# Altium project DCDC.PrjPcb (part 8 of 9)
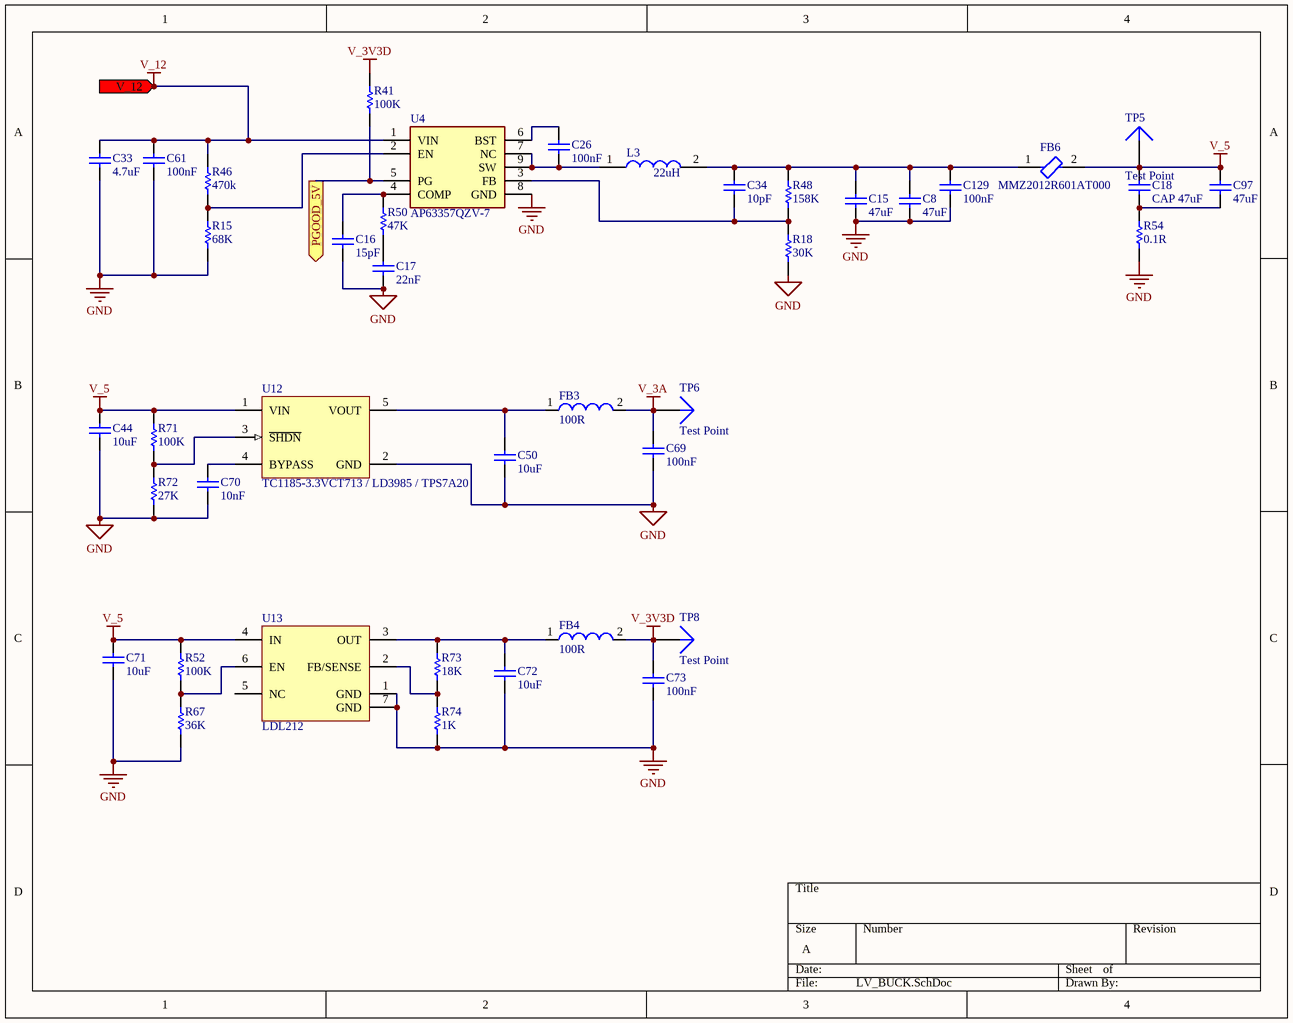
[diagram p14: LV_BUCK.SchDoc]

## Sheet LV_BUCK.SchDoc (continued)

### Library data of the parts (continued)
R72 = CMP-2100-03662-1: ±1% ±100ppm/℃ 0.1W 27kΩ 0603 Chip Resistor - Surface Mount ROHS; Manufacturer: Yageo; Manufacturer Part Number: RC0603FR-07100KL; Power Rating: 100mW; Voltage Rating: 50V; Resistance: 100KOhm; Temperature Coefficient: 100ppm/degreesC; Working Voltage: 75V; Datasheet Version: Rev. 5, 10/2016; Height: 0.45mm; Lead Free: LeadFree; Manufacturer URL: http://www.yageo.com/; Package Reference: 0603; Depth: 0.8mm; RoHSCompliant: true; Composition: ThickFilm; Military Standard: Not; Case/Package: 0603; Packaging: TapeandReel; Case Code (Imperial): 0603; Voltage Rating (DC): 50V; Case Code (Metric): 1608; Tolerance: 1%; Termination: SMD/SMT; Min Operating Temperature: -55degC; Number of Pins: 2; Length: 1.6mm; Width: 0.8mm; Datasheet URL: http://www.yageo.com/NewPortal/yageodocoutput?fileName=/pdf/R-Chip/PYu-RC_Group_51_RoHS_L_5.pdf; Package Description: 2-Pin Surface Mount Device, Body 1.6 x 0.8 mm; Max Operating Temperature: 155degC; REACH SVHC: NoSVHC; Supplier 1: Digi-Key; Supplier Part Number 1: 311-100KHRCT-ND; RoHS: Yes; Category: Chip SMD Resistors; Stock 1: 19283456; Pricing 1: 1=0.10000, 10=0.02400, 100=0.00970, 1000=0.00436, 2500=0.00378 (USD); Series: RC; Max Power Dissipation: 100mW; Resistor Type: Thick Film; Number of Terminations: 2; Resistance Tolerance: 1%; Features: Moisture Resistant; Construction: Rectangular; Technology: THICK FILM; RoHS Compliant: Yes; ComponentLink1URL: https://datasheet.ciiva.com/11808/0900766b80f96399-11808107.pdf?src-supplier=RSComponents; ComponentLink1Description: https://datasheet.ciiva.com/11808/0900766b80f96399-11808107.pdf?src-supplier=RSComponents; ComponentLink2URL: https://datasheet.ciiva.com/7983/443971-7983593.pdf?src-supplier=Element14; ComponentLink2Description: https://datasheet.ciiva.com/7983/443971-7983593.pdf?src-supplier=Element14; ComponentLink3URL: https://datasheet.ciiva.com/46440/1868787-46440889.pdf?src-supplier=Element14; ComponentLink3Description: https://datasheet.ciiva.com/46440/1868787-46440889.pdf?src-supplier=Element14; ComponentLink4URL: https://datasheet.ciiva.com/7746/1738695-7746234.pdf?src-supplier=Element14; ComponentLink4Description: https://datasheet.ciiva.com/7746/1738695-7746234.pdf?src-supplier=Element14; ComponentLink5URL: https://datasheet.ciiva.com/7746/1738695-7746235.pdf?src-supplier=Element14; ComponentLink5Description: https://datasheet.ciiva.com/7746/1738695-7746235.pdf?src-supplier=Element14; ComponentLink6URL: https://datasheet.ciiva.com/22747/443971-22747516.pdf?src-supplier=Element14; ComponentLink6Description: https://datasheet.ciiva.com/22747/443971-22747516.pdf?src-supplier=Element14; Parameter 1: *; JLCPCB Part #: C22967
R73 = CMP-2000-00938-1: 18kΩ ±1% ±100ppm/℃ 0.1W 0603 Chip Resistor - Surface Mount ROHS; Manufacturer: Panasonic; Part Number: ERA3AEB183V; Manufacturer Part Number: ERA-3AEB183V; Resistance: 18kR; Power Rating: 100mW; Tolerance: 0.1%; Temperature Coefficient: 25ppm/°C; Voltage Rating (DC): 75V; Supplier 1: Newark; Supplier Part Number 1: 08N2107; RoHS: Yes; Category: Chip SMD Resistors; Stock 1: 2207; Pricing 1: 1=0.35700, 25=0.30700, 50=0.21600, 100=0.12400, 250=0.10000, 500=0.07500, 1000=0.05100 (USD); Mount: Surface Mount; Case/Package: 0603; Number of Pins: 2; Case Code (Metric): 1608; Case Code (Imperial): 0603; Contact Plating: Tin; Size Code: 0603; Min Operating Temperature: -55°C; Max Operating Temperature: 155°C; Packaging: Tape and Reel; Resistor Type: Thin Film; Number of Terminations: 2; Max Power Dissipation: 100mW; Series: ERA-3A; Voltage Rating: 75V; Package Quantity: 1; Termination: SMD/SMT; Features: Automotive AEC-Q200; Resistance Tolerance: 0.1%; Construction: Rectangular; Technology: METAL FILM; Length: 1.6mm; Width: 0.8mm; Height: 0.45mm; Depth: 0.8mm; Radiation Hardening: No; RoHS Compliant: Yes; Lead Free: Lead Free; REACH SVHC: No SVHC; Military Standard: Not; ComponentLink1URL: https://datasheet.ciiva.com/11808/0900766b80fe20f7-11808020.pdf?src-supplier=RSComponents; ComponentLink1Description: https://datasheet.ciiva.com/11808/0900766b80fe20f7-11808020.pdf?src-supplier=RSComponents; ComponentLink2URL: https://datasheet.ciiva.com/29183/451333-da-01-en-widerstand-0603-era-29183823.pdf?src-supplier=Conrad; ComponentLink2Description: https://datasheet.ciiva.com/29183/451333-da-01-en-widerstand-0603-era-29183823.pdf?src-supplier=Conrad; ComponentLink3URL: https://datasheet.ciiva.com/16395/aoa0000ce26-16395253.pdf?src-supplier=Future+Electronics; ComponentLink3Description: https://datasheet.ciiva.com/16395/aoa0000ce26-16395253.pdf?src-supplier=Future+Electronics; ComponentLink4URL: https://datasheet.ciiva.com/16764/70068849-16764837.pdf?src-supplier=Allied+Electronics; ComponentLink4Description: https://datasheet.ciiva.com/16764/70068849-16764837.pdf?src-supplier=Allied+Electronics; ComponentLink5URL: https://datasheet.ciiva.com/9117/aoa0000ce26-9117398.pdf?src-supplier=Avnet; ComponentLink5Description: https://datasheet.ciiva.com/9117/aoa0000ce26-9117398.pdf?src-supplier=Avnet; ComponentLink6URL: https://datasheet.ciiva.com/17211/aoa0000ce26-17211238.pdf?src-supplier=Avnet+Europe; ComponentLink6Description: https://datasheet.ciiva.com/17211/aoa0000ce26-17211238.pdf?src-supplier=Avnet+Europe; ComponentLink7URL: https://datasheet.ciiva.com/22739/485442-22739288.pdf?src-supplier=Element14; ComponentLink7Description: https://datasheet.ciiva.com/22739/485442-22739288.pdf?src-supplier=Element14; ComponentLink8URL: https://datasheet.ciiva.com/48425/era-eng-tds-48425433.pdf?src-supplier=Distrelec; ComponentLink8Description: https://datasheet.ciiva.com/48425/era-eng-tds-48425433.pdf?src-supplier=Distrelec; ComponentLink9URL: https://datasheet.ciiva.com/48530/era-eng-tds-48530218.pdf?src-supplier=Distrelec; ComponentLink9Description: https://datasheet.ciiva.com/48530/era-eng-tds-48530218.pdf?src-supplier=Distrelec; ComponentLink10URL: https://datasheet.ciiva.com/5860/485442-5860507.pdf?src-supplier=Farnell; ComponentLink10Description: https://datasheet.ciiva.com/5860/485442-5860507.pdf?src-supplier=Farnell; ComponentLink11URL: https://datasheet.ciiva.com/16771/70068849-16771099.pdf?src-supplier=Allied+Electronics; ComponentLink11Description: https://datasheet.ciiva.com/16771/70068849-16771099.pdf?src-supplier=Allied+Electronics; ComponentLink12URL: https://datasheet.ciiva.com/5860/485442-5860508.pdf?src-supplier=Farnell; ComponentLink12Description: https://datasheet.ciiva.com/5860/485442-5860508.pdf?src-supplier=Farnell; ComponentLink13URL: https://datasheet.ciiva.com/7944/485442-7944492.pdf?src-supplier=Element14; ComponentLink13Description: https://datasheet.ciiva.com/7944/485442-7944492.pdf?src-supplier=Element14; ComponentLink14URL: https://datasheet.ciiva.com/30234/54aoa0000ce26-30234638.pdf?src-supplier=Onlinecomponents.com; ComponentLink14Description: https://datasheet.ciiva.com/30234/54aoa0000ce26-30234638.pdf?src-supplier=Onlinecomponents.com; ComponentLink15URL: https://datasheet.ciiva.com/46422/485442-46422590.pdf?src-supplier=Element14; ComponentLink15Description: https://datasheet.ciiva.com/46422/485442-46422590.pdf?src-supplier=Element14; ComponentLink16URL: https://datasheet.ciiva.com/46422/485442-46422591.pdf?src-supplier=Element14; ComponentLink16Description: https://datasheet.ciiva.com/46422/485442-46422591.pdf?src-supplier=Element14; Parameter 1: *; JLCPCB Part #: C25810
R74 = CMP-2000-00180-1: ±1% ±100ppm/℃ 1kΩ 0.1W 0603 Chip Resistor - Surface Mount ROHS; Part Number: ERJ-3EKF1001V; Manufacturer: Panasonic; Manufacturer Part Number: ERJ3EKF1001V; Resistance: 1kR; Power Rating: 100mW; Voltage Rating: 75V; Temperature Coefficient: 100ppm/°C; Supplier 1: Future Electronics; Supplier Part Number 1: 3028514; RoHS: Yes; Category: Chip SMD Resistors; Stock 1: 430000; Pricing 1: 5000=0.01860, 10000=0.01510, 15000=0.01500, 20000=0.01490 (USD); Mount: Surface Mount; Case/Package: 0603; Number of Pins: 2; Case Code (Metric): 1608; Case Code (Imperial): 0603; Contact Plating: Tin; Size Code: 0603; Min Operating Temperature: -55°C; Max Operating Temperature: 155°C; Packaging: Tape and Reel; Tolerance: 1%; Termination: SMD/SMT; Package Quantity: 5000; Series: ERJ; Resistor Type: Thick Film; Max Power Dissipation: 100mW; Construction: Rectangular; Resistance Tolerance: 1%; Number of Terminations: 2; Features: Automotive AEC-Q200; Voltage Rating (DC): 75V; Technology: THICK FILM; Length: 1.6mm; Width: 0.8mm; Height: 0.45mm; Depth: 0.8mm; Radiation Hardening: No; REACH SVHC: No SVHC; Lead Free: Lead Free; RoHS Compliant: Yes; Military Standard: Not; ComponentLink1URL: https://datasheet.ciiva.com/16768/70260748-16768437.pdf?src-supplier=Allied+Electronics; ComponentLink1Description: https://datasheet.ciiva.com/16768/70260748-16768437.pdf?src-supplier=Allied+Electronics; ComponentLink2URL: https://datasheet.ciiva.com/16774/70260748-16774550.pdf?src-supplier=Allied+Electronics; ComponentLink2Description: https://datasheet.ciiva.com/16774/70260748-16774550.pdf?src-supplier=Allied+Electronics; ComponentLink3URL: https://datasheet.ciiva.com/16449/aoa0000ce2-16449065.pdf?src-supplier=Future+Electronics; ComponentLink3Description: https://datasheet.ciiva.com/16449/aoa0000ce2-16449065.pdf?src-supplier=Future+Electronics; ComponentLink4URL: https://datasheet.ciiva.com/7942/aoa0000ce2-7942427.pdf?src-supplier=Element14; ComponentLink4Description: https://datasheet.ciiva.com/7942/aoa0000ce2-7942427.pdf?src-supplier=Element14; ComponentLink5URL: https://datasheet.ciiva.com/9198/aoa0000ce2-9198923.pdf?src-supplier=Avnet; ComponentLink5Description: https://datasheet.ciiva.com/9198/aoa0000ce2-9198923.pdf?src-supplier=Avnet; ComponentLink6URL: https://datasheet.ciiva.com/46373/1678782-46373339.pdf?src-supplier=Element14; ComponentLink6Description: https://datasheet.ciiva.com/46373/1678782-46373339.pdf?src-supplier=Element14; ComponentLink7URL: https://datasheet.ciiva.com/48530/aoa0000ce2-48530987.pdf?src-supplier=Avnet; ComponentLink7Description: https://datasheet.ciiva.com/48530/aoa0000ce2-48530987.pdf?src-supplier=Avnet; ComponentLink8URL: https://datasheet.ciiva.com/46373/1678782-46373340.pdf?src-supplier=Element14; ComponentLink8Description: https://datasheet.ciiva.com/46373/1678782-46373340.pdf?src-supplier=Element14; ComponentLink9URL: https://datasheet.ciiva.com/24070/aoa0000ce2-24070269.pdf?src-supplier=Mouser; ComponentLink9Description: https://datasheet.ciiva.com/24070/aoa0000ce2-24070269.pdf?src-supplier=Mouser; ComponentLink10URL: https://datasheet.ciiva.com/22673/1678782-22673918.pdf?src-supplier=Element14; ComponentLink10Description: https://datasheet.ciiva.com/22673/1678782-22673918.pdf?src-supplier=Element14; ComponentLink11URL: https://datasheet.ciiva.com/30063/aoa0000ce2-30063390.pdf?src-supplier=Onlinecomponents.com; ComponentLink11Description: https://datasheet.ciiva.com/30063/aoa0000ce2-30063390.pdf?src-supplier=Onlinecomponents.com; ComponentLink12URL: https://datasheet.ciiva.com/17215/aoa0000ce2-17215311.pdf?src-supplier=Avnet+Europe; ComponentLink12Description: https://datasheet.ciiva.com/17215/aoa0000ce2-17215311.pdf?src-supplier=Avnet+Europe; Parameter 1: *; JLCPCB Part #: C21190
TP5 TP6 TP8 = Test_Point 1.5mm round: Round Test Point; LatestRevisionDate: 17-Jul-2002; LatestRevisionNote: Re-released for DXP Platform.; Publisher: Altium Limited; Parameter 1: *; JLCPCB Part #: *
U4 = AP63357QZV-7: Integrated Circuit; Manufacturer_Name: Diodes Inc.; Datasheet Link: https://www.diodes.com/assets/Datasheets/AP63356Q_AP63357Q.pdf; Height: 0.85mm; Manufacturer_Part_Number: AP63357QZV-7; Mouser Part Number: 621-AP63357QZV-7; Mouser Price/Stock: https://www.mouser.co.uk/ProductDetail/Diodes-Incorporated/AP63357QZV-7?qs=DPoM0jnrROUeS%2FU8ZrDy%2FA%3D%3D; Parameter 1: *; JLCPCB Part #: *
U12 = PM-LINEREG-TC1014-IL5: 50 mA, 100 mA and 150 mA CMOS LDOs with Active-Low Shutdown and Reference Bypass, 5-Pin SOT-23, Extended Temperature, Tape and Reel; PackageVersion: revBB, Aug-2009; Code_IPC: SOT23-5; PackageDescription: 5-Lead Plastic Small Outline Transistor (CT) [SOT-23]; DatasheetVersion: revE, Feb-2007; PackageReference: SOT-23-CT5; Parameter 1: *; JLCPCB Part #: *
U13 = LDL212: Parameter 1: *; JLCPCB Part #: *

## Sheet CAN.SchDoc
size A; SheetNumber: 7; SheetTotal: 8
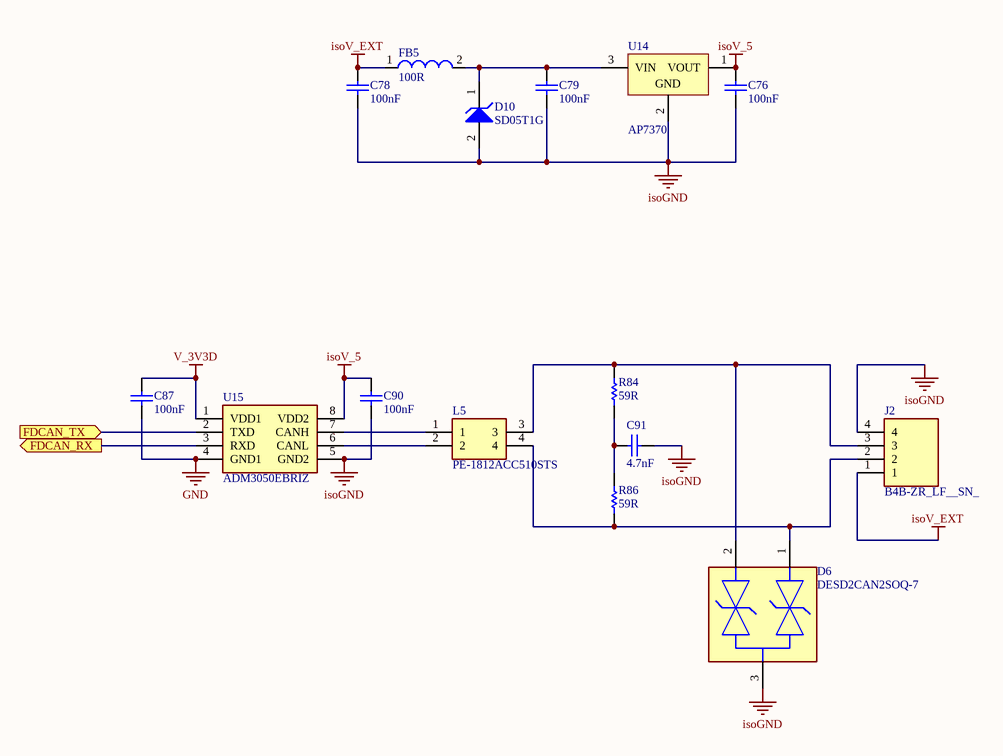
[diagram p7: CAN.SchDoc]

### Parts
C76  100nF  [CAPC1608X90X35NL10T15]
C78  100nF  [CAPC1608X90X35NL10T15]
C79  100nF  [CAPC1608X90X35NL10T15]
C87  100nF  [CAPC1608X90X35NL10T15]
C90  100nF  [CAPC1608X90X35NL10T15]
C91  4.7nF  [CAPC1608X90X35ML10T15]
D6  DESD2CAN2SOQ-7  [FP-SOT23-MFG]
D10  SD05T1G  [ONSC-SOD-323-2-477-02_G_V]
FB5  100R  [SMD-0603]
J2  B4B-ZR_LF__SN_  [SHDR4W50P0X150_1X4_750X350X450P]
L5  PE-1812ACC510STS  [PE1812ACC510STS]
R84  59R  [RESC1608X55X30ML15T15]
R86  59R  [RESC1608X55X30ML15T15]
U14  AP7370  [SOT-89_L]
U15  ADM3050EBRIZ  [SOIC127P1031X265-8N]

### Ports
FDCAN_RX (out), FDCAN_TX (in)

### Nets
GND: C87.1 U15.4(GND1)
isoGND: C76.1 C78.1 C79.1 C90.1 C91.2 D6.3 D10.2(A) J2.4 U14.2(GND) U15.5(GND2)
isoV_5: C76.2 C90.2 U14.1(VOUT) U15.8(VDD2)
isoV_EXT: C78.2 FB5.1 J2.1
V_3V3D: C87.2 U15.1(VDD1)
NetC79_2: C79.2 D10.1(K) FB5.2 U14.3(VIN)
NetC91_1: C91.1 R84.1 R86.2
NetD6_1: D6.1 J2.2 L5.4 R86.1
NetD6_2: D6.2 J2.3 L5.3 R84.2
NetL5_1: L5.1 U15.7(CANH)
NetL5_2: L5.2 U15.6(CANL)
NetU1_108: U15.3(RXD) ; port FDCAN_RX
NetU1_109: U15.2(TXD) ; port FDCAN_TX

### Library data of the parts
C76 C78 C79 C87 C90 = CAP: X7R 100nF ±10% 50V 0603 Multilayer Ceramic Capacitors MLCC - SMD/SMT ROHS; Part Number: GCM188R72A104KA64D; Manufacturer: Murata; Manufacturer Part Number: CC0603KRX7R9BB104; Voltage Rating: 100V; Supplier 1: Arrow Electronics; Supplier Part Number 1: GCM188R72A104KA64D; RoHS: Yes; Category: Ceramic Capacitors; Mount: Surface Mount; Case/Package: 0603; Case Code (Imperial): 0603; Case Code (Metric): 1608; Min Operating Temperature: -55°C; Max Operating Temperature: 125°C; Tolerance: 10%; Packaging: Tape and Reel; Capacitance: 100nF; Dielectric: X7R; Termination: SMD/SMT; Voltage Rating (DC): 100V; Length: 1.6mm; Height: 0.8mm; Depth: 0.8mm; Radiation Hardening: No; ComponentLink1URL: https://datasheet.ciiva.com/17451/product-17451047.pdf?src-supplier=Avnet+Europe; ComponentLink1Description: https://datasheet.ciiva.com/17451/product-17451047.pdf?src-supplier=Avnet+Europe; ComponentLink2URL: https://datasheet.ciiva.com/26889/getdatasheetpartid-387765-26889164.pdf?src-supplier=Verical; ComponentLink2Description: https://datasheet.ciiva.com/26889/getdatasheetpartid-387765-26889164.pdf?src-supplier=Verical; Parameter 1: *; JLCPCB Part #: C14663
C91 = CMP-2006-02924-1: X7R ±10% 4.7nF 50V 0603 Multilayer Ceramic Capacitors MLCC - SMD/SMT ROHS; Part Number: GRM188R71H472KA01D; Manufacturer: Murata; Insulation Resistance: 10GR; Supplier 1: Farnell; Supplier Part Number 1: 1118177; Manufacturer Part Number: GRM188R71H472KA01D; RoHS: Yes; Category: Ceramic Capacitors; Pricing 1: 1=19.92000, 3=19.13000 (GBP); Mount: Surface Mount; Case/Package: 0603; Number of Pins: 2; Case Code (Imperial): 0603; Case Code (Metric): 1608; Dielectric Material: Ceramic; Material: Ceramic; Min Operating Temperature: -55°C; Max Operating Temperature: 125°C; Capacitance: 4.7nF; Voltage Rating (DC): 50V; Tolerance: 10%; Packaging: Tape and Reel; Dielectric: X7R; Series: GRM; Voltage Rating: 50V; Package Quantity: 1; Termination: SMD/SMT; Voltage: 50V; Length: 1.6mm; Width: 0.8mm; Height: 0.8mm; Depth: 0.8mm; Thickness: 0.035inch; Radiation Hardening: No; RoHS Compliant: Yes; REACH SVHC: No SVHC; Lead Free: Lead Free; ComponentLink1URL: https://datasheet.ciiva.com/5412/product-5412608.pdf?src-supplier=Mouser; ComponentLink1Description: https://datasheet.ciiva.com/5412/product-5412608.pdf?src-supplier=Mouser; ComponentLink2URL: https://datasheet.ciiva.com/18102/getdatasheetpartid-75298-18102657.pdf?src-supplier=Verical; ComponentLink2Description: https://datasheet.ciiva.com/18102/getdatasheetpartid-75298-18102657.pdf?src-supplier=Verical; ComponentLink3URL: https://datasheet.ciiva.com/11787/0900766b8003061f-11787116.pdf?src-supplier=RSComponents; ComponentLink3Description: https://datasheet.ciiva.com/11787/0900766b8003061f-11787116.pdf?src-supplier=RSComponents; ComponentLink4URL: https://datasheet.ciiva.com/29201/451888-da-01-en-vs-kondensator-0603-29201828.pdf?src-supplier=Conrad; ComponentLink4Description: https://datasheet.ciiva.com/29201/451888-da-01-en-vs-kondensator-0603-29201828.pdf?src-supplier=Conrad; ComponentLink5URL: https://datasheet.ciiva.com/7937/4360-7937669.pdf?src-supplier=Element14; ComponentLink5Description: https://datasheet.ciiva.com/7937/4360-7937669.pdf?src-supplier=Element14; ComponentLink6URL: https://datasheet.ciiva.com/48428/nmgrm-data-en-48428597.pdf?src-supplier=Distrelec; ComponentLink6Description: https://datasheet.ciiva.com/48428/nmgrm-data-en-48428597.pdf?src-supplier=Distrelec; ComponentLink7URL: https://datasheet.ciiva.com/7937/4360-7937670.pdf?src-supplier=Element14; ComponentLink7Description: https://datasheet.ciiva.com/7937/4360-7937670.pdf?src-supplier=Element14; ComponentLink8URL: https://datasheet.ciiva.com/7937/4360-7937671.pdf?src-supplier=Element14; ComponentLink8Description: https://datasheet.ciiva.com/7937/4360-7937671.pdf?src-supplier=Element14; ComponentLink9URL: https://datasheet.ciiva.com/130/partnumbering-e-01-130733.pdf?src-supplier=Digi-Key; ComponentLink9Description: https://datasheet.ciiva.com/130/partnumbering-e-01-130733.pdf?src-supplier=Digi-Key; ComponentLink10URL: https://datasheet.ciiva.com/130/partnumbering-e-01-130734.pdf?src-supplier=Digi-Key; ComponentLink10Description: https://datasheet.ciiva.com/130/partnumbering-e-01-130734.pdf?src-supplier=Digi-Key; ComponentLink11URL: https://datasheet.ciiva.com/130/partnumbering-e-01-130735.pdf?src-supplier=Digi-Key; ComponentLink11Description: https://datasheet.ciiva.com/130/partnumbering-e-01-130735.pdf?src-supplier=Digi-Key; Parameter 1: *; JLCPCB Part #: C53987
D6 = CMP-12828-000016-1: TVS DIODE 24V 41V SOT23; Manufacturer: Diodes Inc.; Peak Pulse Current: 5A; Automotive Grade: Grade 0; Value: 25pF; Number Of Channels: 2; Direction: Bidirectional; Max Junction Temp: +150°C; Breakdown Voltage: 25.4V; Peak Pulse Power: 230W; Standoff Height: 0.013mm; ComponentLink2Description: Datasheet; Temperature Range High: +150°C; Device Class L2: TVS Diodes; Octopart: https://octopart.com/desd2can2soq-7-diodes+inc.-53081564; Device Class L3: unset; RoHS: TRUE; ComponentLink2URL: https://www.diodes.com/assets/Datasheets/DESD2CAN2SOQ.pdf; Height: 1.1mm; Digikey Description: TVS DIODE 24V 41V SOT23; Footprint Url: https://www.diodes.com/assets/Package-Files/SOT23.pdf; Manufacturer Part Number: DESD2CAN2SOQ-7; Package: SOT23; Temperature: -65°C to +150°C; Mouser Description: ESD Suppressors / TVS Diodes Dual CAN Bus ESD 25pF 24V 25.4V; Capacitance: 25pF; Category: Diode; Clamping Voltage: 41V; Lead Free: Yes; Reverse Standoff Voltage: 24V; Device Class L1: Circuit Protection; Temperature Range Low: -65°C; Automotive: Yes; Parameter 1: *; JLCPCB Part #: *
D10 = CMP-1061-00629-1: Transient Voltage Suppressor Diode, for ESD Protection, 2-Pin SOD-323, Pb-Free, Tape and Reel; Manufacturer: On Semiconductor; PPK Max (W): 350; IR Max (uA): 10; Direction: Unidirectional; ComponentLink1Description: Manufacturer URL; PackageReference: SOD-323-2-477-02_G; Mounting Technology: Surface Mount; PackageVersion: Rev. G, 02/2005; ComponentLink2URL: http://www.onsemi.com/pub_link/Collateral/SD05T1-D.PDF; PackageDescription: 2-Pin SOD, Body 1.7 x 1.25 mm; Packing: Tape and Reel; ComponentLink2Description: Datasheet; ComponentLink1URL: http://www.onsemi.com/; ComponentLink3Description: Package Specification; ComponentLink3URL: http://www.onsemi.com/pub_link/Collateral/SD05T1-D.PDF; PartNumber: SD05T1G; RoHS: Pb-Free; DatasheetVersion: Rev. 2; Parameter 1: *; JLCPCB Part #: *
FB5 = CMP-0220-00115-1: SMD EMI Suppression Ferrite Bead WE-CBF, Z = 1500 Ohm; DatasheetVersion: Dec-2005; ComponentLink1URL: http://www.we-online.com; PackageVersion: 2009; PackageDescription: Chip Inductor, 2-Leads, Body 1.6 x 0.8 mm; ComponentLink2URL: http://www.we-online.de/katalog/media/pdf/742792691.pdf; ComponentLink1Description: Manufacturer Link; ComponentLink2Description: Datasheet; Impedance: 1500 Ohm; PackageReference: SMD-0603; Parameter 1: *; JLCPCB Part #: *
J2 = B4B-ZR_LF__SN_: Connector; Manufacturer_Name: JST (JAPAN SOLDERLESS TERMINALS); Manufacturer_Part_Number: B4B-ZR(LF)(SN); Datasheet Link: http://docs-emea.rs-online.com/webdocs/1147/0900766b81147f94.pdf; Height: 4.5mm; Arrow Part Number: B4B-ZR(LF)(SN); Arrow Price/Stock: https://www.arrow.com/en/products/b4b-zr-lf-sn/jst-manufacturing; Parameter 1: *; JLCPCB Part #: *
L5 = PE-1812ACC510STS: Inductor; Manufacturer_Name: Pulse; Datasheet Link: https://productfinder.pulseeng.com/doc_type/WEB301/doc_num/W717/doc_part/W717.pdf; Height: 3mm; Manufacturer_Part_Number: PE-1812ACC510STS; Mouser Part Number: 673-PE-1812ACC510STS; Mouser Price/Stock: https://www.mouser.co.uk/ProductDetail/Pulse-Electronics/PE-1812ACC510STS?qs=ar8LaIfZsbGrh9tcPYNGNA%3D%3D; Arrow Part Number: PE-1812ACC510STS; Arrow Price/Stock: https://www.arrow.com/en/products/pe-1812acc510sts/pulse-electronics-corporation; Parameter 1: *; JLCPCB Part #: *
R84 R86 = CMP-2000-00583-1: Manufacturer: Panasonic; Part Number: ERJ-3EKF59R0V; Power Rating: 100mW; Tolerance: 1%; Temperature Coefficient: 100ppm/°C; Voltage Rating: 75V; Voltage Rating (DC): 50V; Supplier 1: Digi-Key; Supplier Part Number 1: P59.0HCT-ND; Manufacturer Part Number: ERJ-3EKF59R0V; RoHS: Yes; Category: Chip SMD Resistors; Stock 1: 12961; Pricing 1: 1=0.10000, 10=0.03700, 100=0.01490, 1000=0.00670, 2500=0.00582 (USD); Mount: Surface Mount; Case/Package: 0603; Case Code (Metric): 1608; Case Code (Imperial): 0603; Contact Plating: Tin; Min Operating Temperature: -55°C; Max Operating Temperature: 155°C; Resistance: 59R; Packaging: Tape and Reel; Resistor Type: Thick Film; Number of Terminations: 2; Package Quantity: 1; Max Power Dissipation: 100mW; Series: ERJ; Termination: SMD/SMT; Resistance Tolerance: 1%; Features: Automotive AEC-Q200; Technology: THICK FILM; Construction: Rectangular; Length: 1.6mm; Width: 0.031inch; Height: 0.45mm; Depth: 0.8mm; RoHS Compliant: Yes; REACH SVHC: Yes; Lead Free: Contains Lead; Military Standard: Not; ComponentLink1URL: https://datasheet.ciiva.com/9188/aoa0000ce2-9188485.pdf?src-supplier=Avnet; ComponentLink1Description: https://datasheet.ciiva.com/9188/aoa0000ce2-9188485.pdf?src-supplier=Avnet; ComponentLink2URL: https://datasheet.ciiva.com/46420/1678782-46420341.pdf?src-supplier=Element14; ComponentLink2Description: https://datasheet.ciiva.com/46420/1678782-46420341.pdf?src-supplier=Element14; ComponentLink3URL: https://datasheet.ciiva.com/22729/1678782-22729158.pdf?src-supplier=Farnell; ComponentLink3Description: https://datasheet.ciiva.com/22729/1678782-22729158.pdf?src-supplier=Farnell; ComponentLink4URL: https://datasheet.ciiva.com/22673/1678782-22673800.pdf?src-supplier=Element14; ComponentLink4Description: https://datasheet.ciiva.com/22673/1678782-22673800.pdf?src-supplier=Element14; ComponentLink5URL: https://datasheet.ciiva.com/9188/aoa0000ce2-9188489.pdf?src-supplier=Avnet; ComponentLink5Description: https://datasheet.ciiva.com/9188/aoa0000ce2-9188489.pdf?src-supplier=Avnet; ComponentLink6URL: https://datasheet.ciiva.com/30242/aoa0000ce2-30242153.pdf?src-supplier=Onlinecomponents.com; ComponentLink6Description: https://datasheet.ciiva.com/30242/aoa0000ce2-30242153.pdf?src-supplier=Onlinecomponents.com; ComponentLink7URL: https://datasheet.ciiva.com/16777/70260748-16777979.pdf?src-supplier=Allied+Electronics; ComponentLink7Description: https://datasheet.ciiva.com/16777/70260748-16777979.pdf?src-supplier=Allied+Electronics; Parameter 1: *; JLCPCB Part #: *
U14 = CMP-0244-00401-1: Ultra Low Drop Voltage Regulators with Inhibit, Low ESR Output Capacitors Compatible, 3.3V, 3-Pin SOT-89, Tape and Reel; ComponentLink1Description: Manufacturer URL; ComponentLink2URL: http://www.st.com/internet/com/TECHNICAL_RESOURCES/TECHNICAL_LITERATURE/DATASHEET/CD00001635.pdf; PackageReference: SOT-89; DatasheetVersion: 14/07/2008; ComponentLink2Description: Datasheet; ComponentLink1URL: http://www.st.com; PackageDescription: 3-Pin SOT-89 Package 1.5 mm Pitch, 4.1 mm Lead Span; PackageVersion: 2011; Parameter 1: *; JLCPCB Part #: *
U15 = ADM3050EBRIZ: Integrated Circuit; Manufacturer_Name: Analog Devices; Datasheet Link: https://www.mouser.com/datasheet/2/609/ADM3050E-EP-1542022.pdf; Height: 2.65mm; Manufacturer_Part_Number: ADM3050EBRIZ; Mouser Part Number: 584-ADM3050EBRIZ; Mouser Price/Stock: https://www.mouser.co.uk/ProductDetail/Analog-Devices/ADM3050EBRIZ?qs=P1JMDcb91o7QWLbXtXYo%2Fw%3D%3D; Arrow Part Number: ADM3050EBRIZ; Arrow Price/Stock: https://www.arrow.com/en/products/adm3050ebriz/analog-devices?region=nac; Parameter 1: *; JLCPCB Part #: *

## Sheet WIFI.SchDoc
size A; SheetNumber: 8; SheetTotal: 8
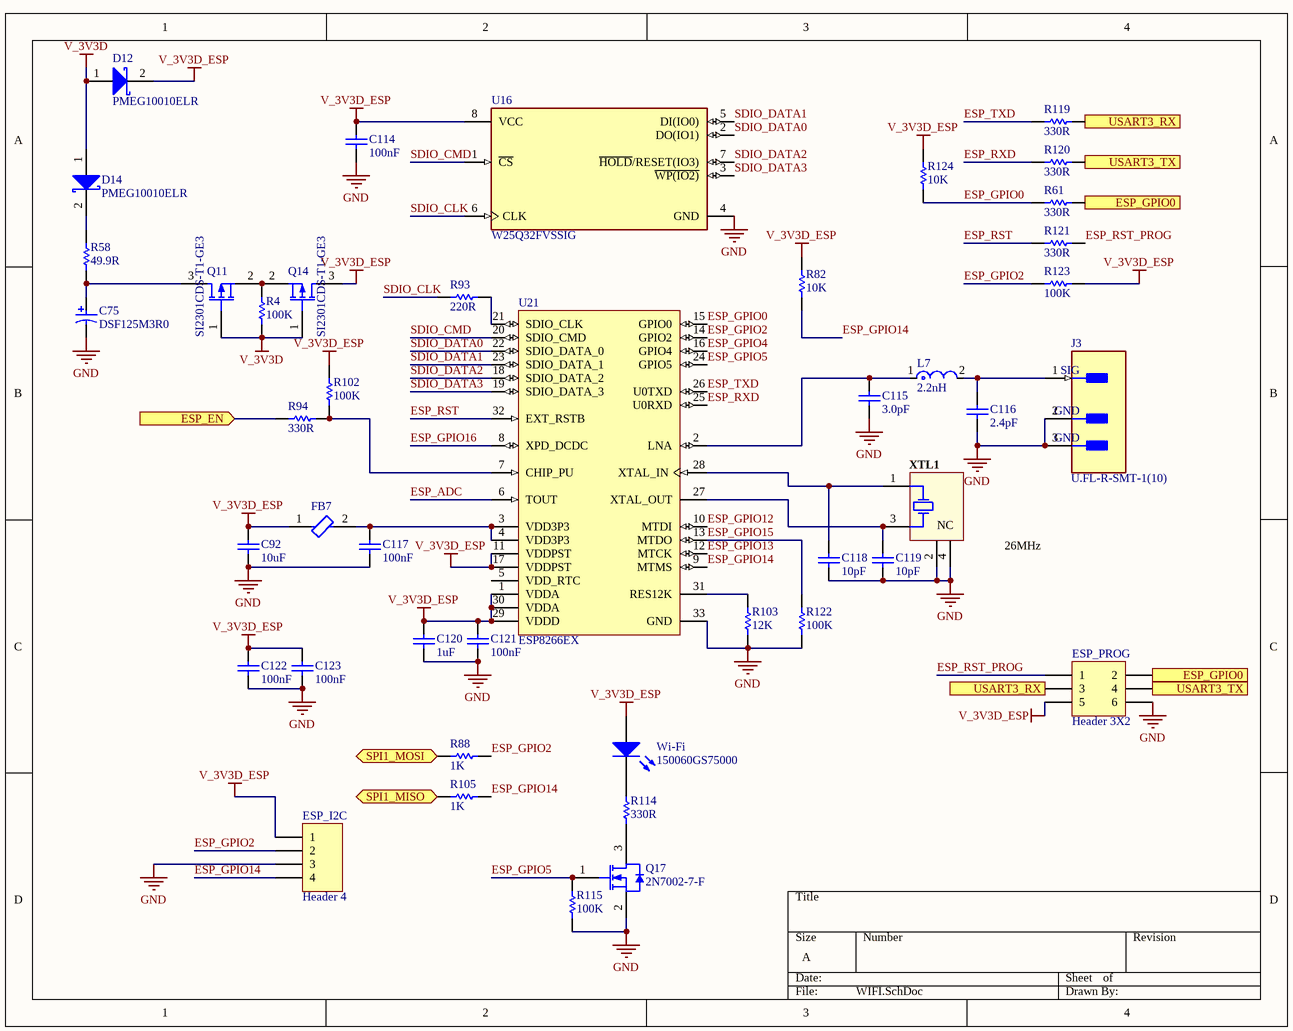
[diagram p8: WIFI.SchDoc]

### Parts
C75  DSF125M3R0  [CAPPR55-250-1120X630X1220]
C92  10uF  [CAPC2013X140X45NL15T25]
C114  100nF  [CAPC1608X90X35NL10T15]
C115  3.0pF  [CAPC1005X55X25NL05T10]
C116  2.4pF  [CAPC1005X55X25NL05T10]
C117  100nF  [CAPC1005X56X25NL10T15]
C118  10pF  [CAPC1005X55X25NL05T10]
C119  10pF  [CAPC1005X55X25NL05T10]
C120  1uF  [CAPC1608X86X35NL15T15]
C121  100nF  [CAPC1005X56X25NL10T15]
C122  100nF  [CAPC1005X56X25NL10T15]
C123  100nF  [CAPC1005X56X25NL10T15]
D12  PMEG10010ELR  [DIOD-SOD-123-2_V]
D14  PMEG10010ELR  [DIOD-SOD-123-2_V]
ESP_I2C  Header 4  [HDR1X4]
ESP_PROG  Header 3X2  [HDR2X3]
FB7  BLM15AG601SN1D  [FP-BLM15-0_05-IPC_B]  (value not drawn)
J3  U.FL-R-SMT-1(10)  [FP-U_FL-R-SMT-1_10-MFG]
L7  2.2nH  [FP-LQG15HH_02-MFG]
Q11  SI2301CDS-T1-GE3  [INF-PG-SOT23_N]
Q14  SI2301CDS-T1-GE3  [INF-PG-SOT23_N]
Q17  2N7002-7-F  [DIOD-SOT23-3_V]
R4  100K  [RESC1608X55X25NL10T15]
R58  49.9R  [RESC1608X55X30ML15T15]
R61  330R  [RESC1608X55X25NL10T15]
R82  10K  [RESC1005X40X25NL05T10]
R88  1K  [RESC1005X40X25NL05T10]
R93  220R  [RESC1005X40X25NL05T10]
R94  330R  [RESC1608X55X25NL10T15]
R102  100K  [RESC1608X55X25NL10T15]
R103  12K  [RESC1005X40X25ML05T05]
R105  1K  [RESC1005X40X25NL05T10]
R114  330R  [RESC1608X55X25NL10T15]
R115  100K  [RESC1608X55X25ML10T15]
R119  330R  [RESC1608X55X25NL10T15]
R120  330R  [RESC1608X55X25NL10T15]
R121  330R  [RESC1608X55X25NL10T15]
R122  100K  [RESC1608X55X25NL10T15]
R123  100K  [RESC1608X55X25NL10T15]
R124  10K  [RESC1608X55X25NL10T15]
U16  W25Q32FVSSIG  [FP-SS-MFG]
U21  ESP8266EX  [ESFS-QFN-32_L]
Wi-Fi  150060GS75000  [0603_A]
XTL1  26MHz  [AVX-CX3225GB-4_V]

### Ports
ESP_EN (in), ESP_GPIO0 (out), SPI1_MISO (bidir), SPI1_MOSI (bidir), USART3_RX (out), USART3_TX (in)

### Nets
GND: C75.2 C92.1 C114.1 C115.1 C116.1 C117.1 C118.2 C119.2 C120.1 C121.1 C122.1 C123.1 ESP_I2C.3 ESP_PROG.6 J3.2(GND) J3.3(GND) Q17.2(S) R103.1 R115.1 R122.1 U16.4(GND) U21.33(GND) XTL1.2(NC) XTL1.4(NC)
V_3V3D: D12.1(A) D14.1(A) Q11.1(G) Q14.1(G) R4.1
V_3V3D_ESP: C92.2 C114.2 C120.2 C121.2 C122.2 C123.2 D12.2(K) ESP_I2C.1 ESP_PROG.5 FB7.1 Q14.3(D) R82.2 R102.1 R123.2 R124.2 U16.8(VCC) U21.1(VDDA) U21.11(VDDPST) U21.17(VDDPST) U21.29(VDDD) U21.30(VDDA) Wi-Fi.2(A)
ESP_ADC: U21.6(TOUT)
ESP_GPIO0: R61.1 R124.1 U21.15(GPIO0)
ESP_GPIO2: ESP_I2C.2 R88.2 R123.1 U21.14(GPIO2)
ESP_GPIO4: U21.16(GPIO4)
ESP_GPIO5: Q17.1(G) R115.2 U21.24(GPIO5)
ESP_GPIO12: U21.10(MTDI)
ESP_GPIO13: U21.12(MTCK)
ESP_GPIO14: ESP_I2C.4 R82.1 R105.2 U21.9(MTMS)
ESP_GPIO15: R122.2 U21.13(MTDO)
ESP_GPIO16: U21.8(XPD_DCDC)
ESP_RST: R121.1 U21.32(EXT_RSTB)
ESP_RST_PROG: ESP_PROG.1 R121.2
ESP_RXD: R120.1 U21.25(U0RXD)
ESP_TXD: R119.1 U21.26(U0TXD)
SDIO_CLK: R93.1 U16.6(CLK)
SDIO_CMD: U16.1(~{CS}) U21.20(SDIO_CMD)
SDIO_DATA0: U16.2(DO(IO1)) U21.22(SDIO_DATA_0)
SDIO_DATA1: U16.5(DI(IO0)) U21.23(SDIO_DATA_1)
SDIO_DATA2: U16.7(~{HOLD}/RESET(IO3)) U21.18(SDIO_DATA_2)
SDIO_DATA3: U16.3(~{WP(IO2)}) U21.19(SDIO_DATA_3)
SPI1_MISO: R105.1 ; port SPI1_MISO
SPI1_MOSI: R88.1 ; port SPI1_MOSI
NetC75_1: C75.1 Q11.3(D) R58.1
NetC115_2: C115.2 L7.1 U21.2(LNA)
NetC116_2: C116.2 J3.1(SIG) L7.2
NetC117_2: C117.2 FB7.2 U21.3(VDD3P3) U21.4(VDD3P3)
NetC118_1: C118.1 U21.28(XTAL_IN) XTL1.1(HOT)
NetC119_1: C119.1 U21.27(XTAL_OUT) XTL1.3(HOT)
NetD14_2: D14.2(K) R58.2
NetESP_PROG_2: ESP_PROG.2 R61.2 ; port ESP_GPIO0
NetESP_PROG_3: ESP_PROG.3 R119.2 ; port USART3_RX
NetESP_PROG_4: ESP_PROG.4 R120.2 ; port USART3_TX
NetQ11_2: Q11.2(S) Q14.2(S) R4.2
NetQ17_3: Q17.3(D) R114.2
NetR93_2: R93.2 U21.21(SDIO_CLK)
NetR94_1: R94.1 R102.2 U21.7(CHIP_PU)
NetR94_2: R94.2 ; port ESP_EN
NetR103_2: R103.2 U21.31(RES12K)
NetR114_1: R114.1 Wi-Fi.1(K)

Not connected (* = marked no-connect by the designer): U21 5(VDD_RTC)